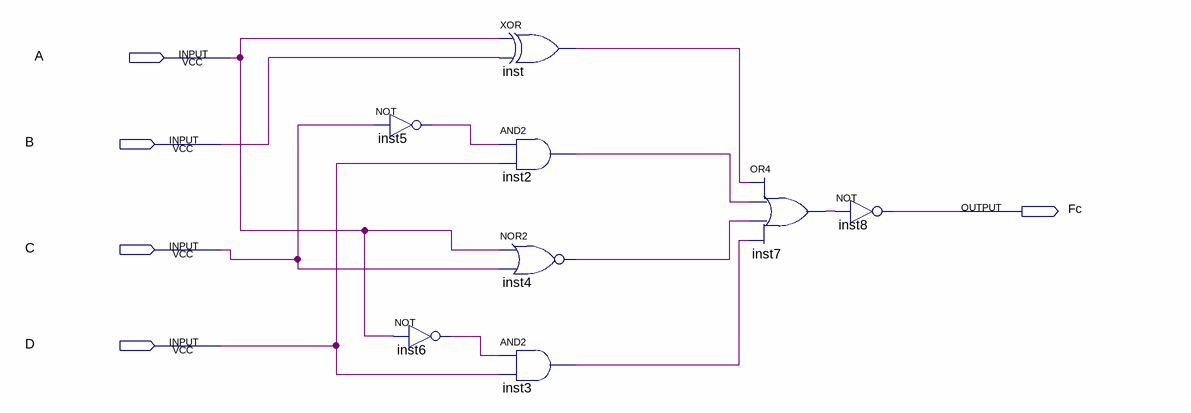
[diagram p0: schematic sheet]
// Quartus schematic fc.bdf as structural Verilog: 8 symbols, 5 pins
module fc (
  input  A,
  input  B,
  input  C,
  input  D,
  output Fc
);

  wire inst2_out, inst3_out, inst4_out, inst5_out, inst6_out, inst7_out, inst_out;

  not inst5 (inst5_out, C);
  not inst6 (inst6_out, A);
  xor inst (inst_out, A, B);
  and inst2 (inst2_out, inst5_out, D);
  nor inst4 (inst4_out, A, C);
  and inst3 (inst3_out, inst6_out, D);
  or inst7 (inst7_out, inst_out, inst2_out, inst4_out, inst3_out);
  not inst8 (Fc, inst7_out);
endmodule
